# Altium schematic sheet [9]-STM32F407 Controller.SchDoc
size A3; Organization: Altium Limited; Address1: L3, 12a Rodborough Rd; Address2: Frenchs Forest; Address3: NSW; Address4: Australia 2086
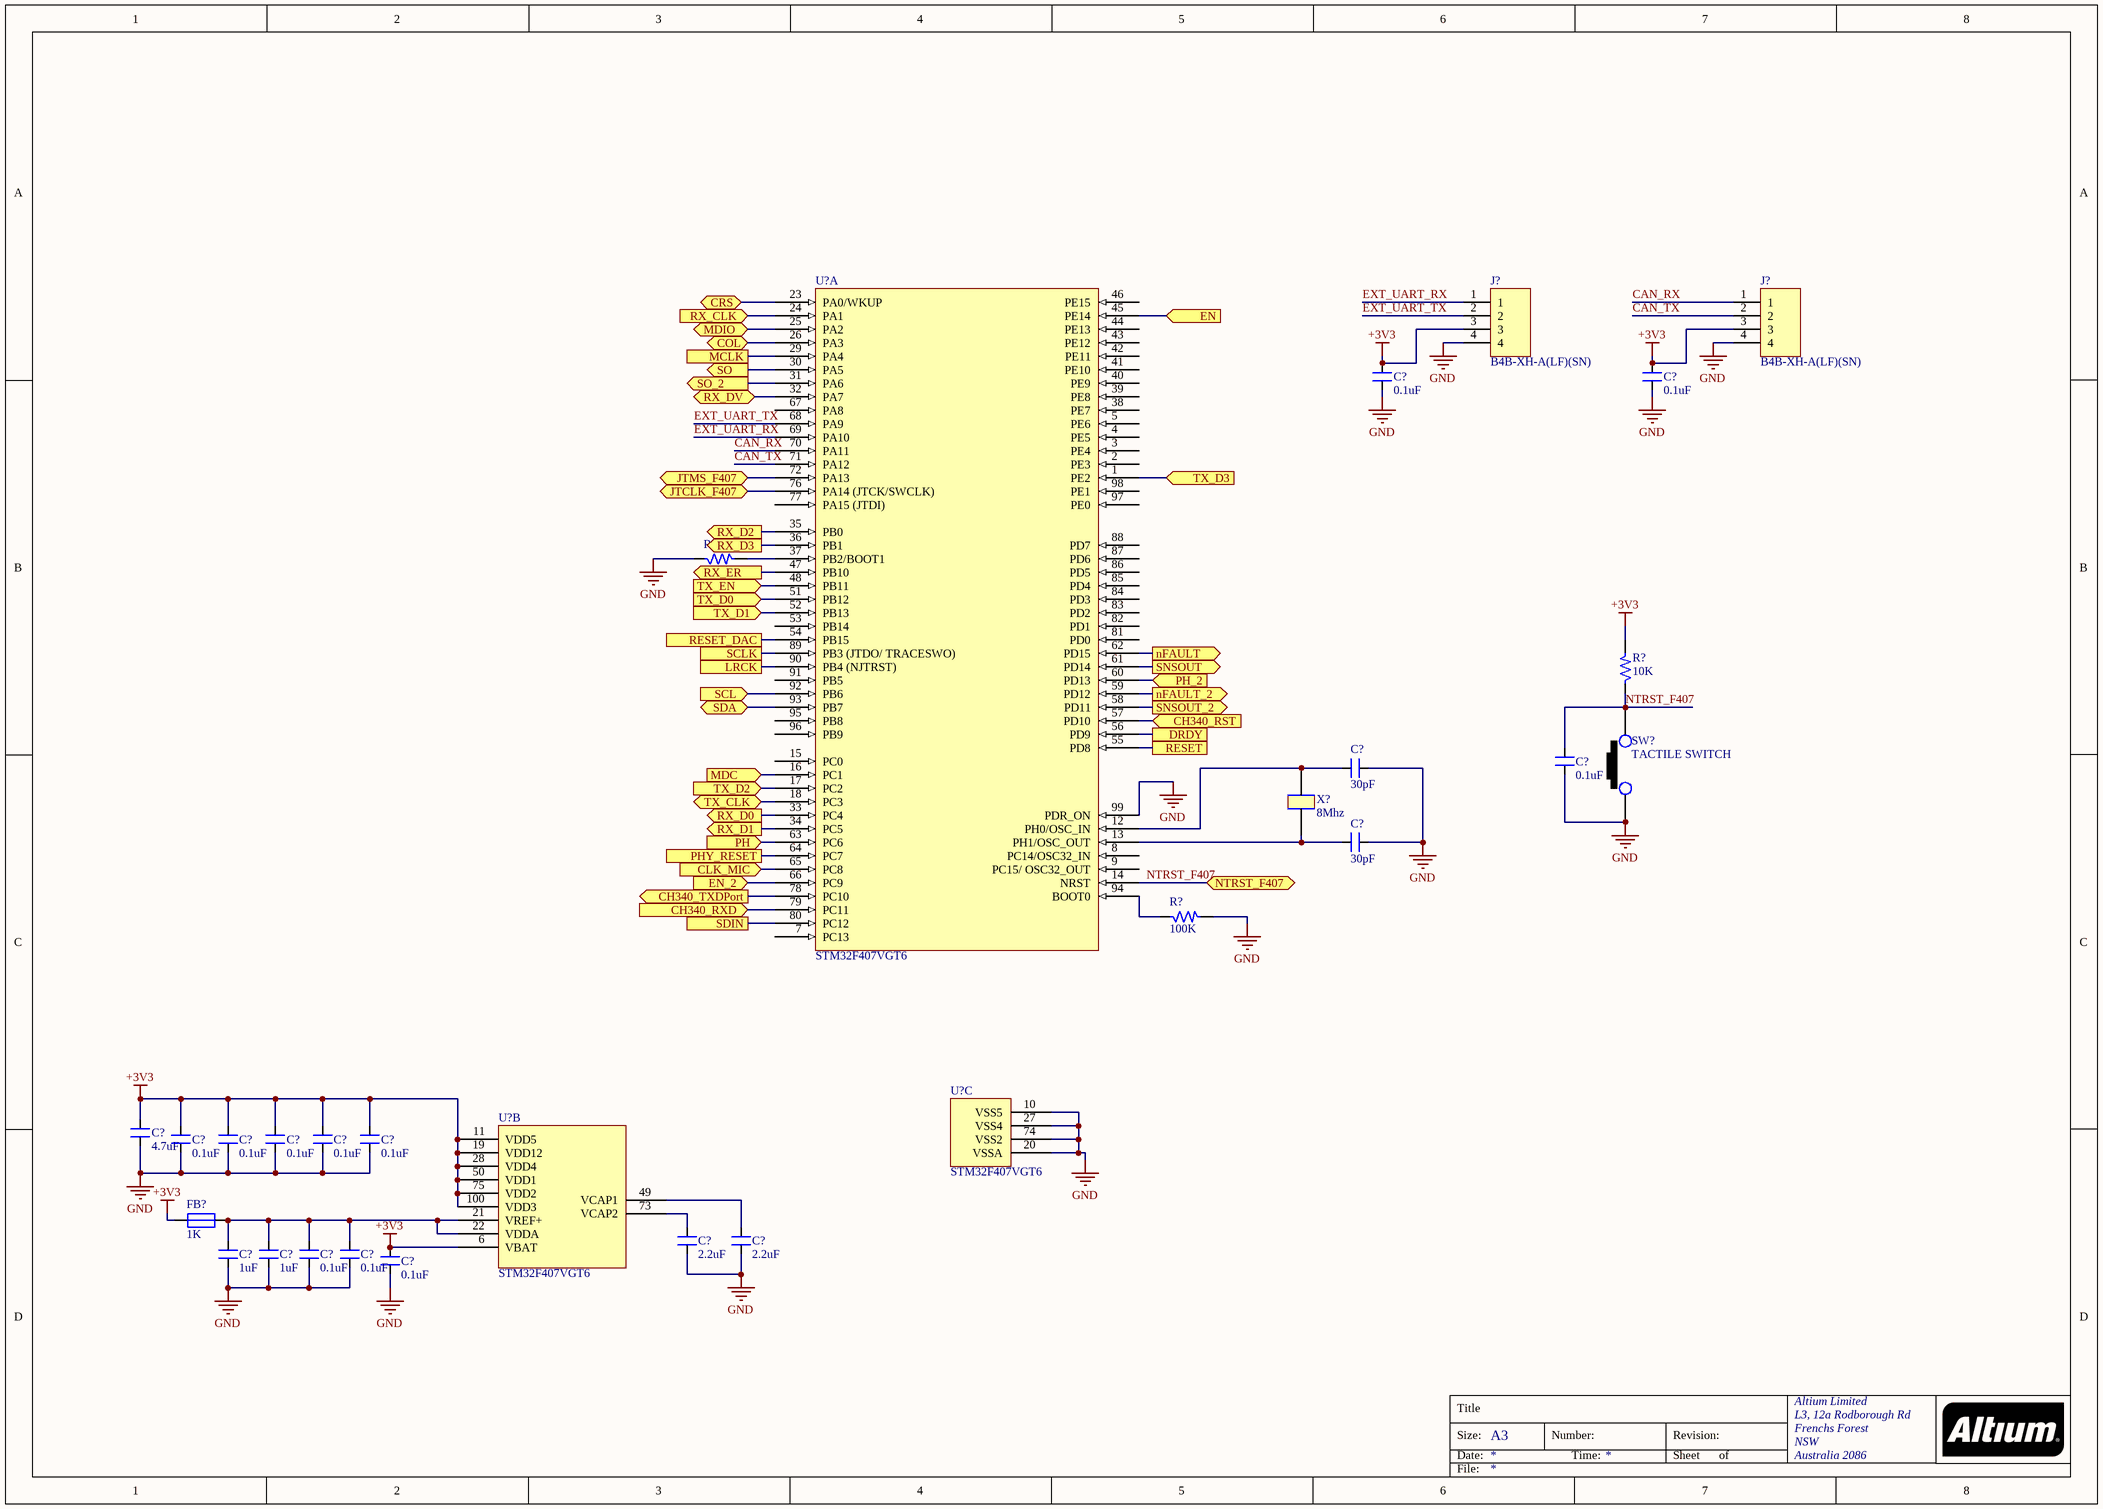
[diagram p0: [9]-STM32F407 Controller.SchDoc]

## Parts
(Parts that share a designator on the sheet are numbered #1, #2 ... from top to bottom, then left to right.)
C?#1  0.1uF  [CAP_0805]
C?#2  0.1uF  [CAP_0805]
C?#3  0.1uF  [CAP_0805]
C?#4  30pF  [CAP_0805]
C?#5  30pF  [CAP_0805]
C?#6  4.7uF  [CAP_0805]
C?#7  0.1uF  [CAP_0805]
C?#8  0.1uF  [CAP_0805]
C?#9  0.1uF  [CAP_0805]
C?#10  0.1uF  [CAP_0805]
C?#11  0.1uF  [CAP_0805]
C?#12  2.2uF  [CAP_0805]
C?#13  2.2uF  [CAP_0805]
C?#14  1uF  [CAP_0805]
C?#15  1uF  [CAP_0805]
C?#16  0.1uF  [CAP_0805]
C?#17  0.1uF  [CAP_0805]
C?#18  0.1uF  [CAP_0805]
FB?  1K  [IND_0805]
J?#1  B4B-XH-A(LF)(SN)  [CON4_100_B4B-XH-A_TH_ST]
J?#2  B4B-XH-A(LF)(SN)  [CON4_100_B4B-XH-A_TH_ST]
R?#1  100K  [RES_0603]
R?#2  10K  [RES_0603]
R?#3  100K  [RES_0603]
SW?  TACTILE SWITCH  [SW_342_SMD]
U?#1  STM32F407VGT6  [QFN100_19.6_669_58X10_SMD]  (part A of 3)
U?#2  STM32F407VGT6  [QFN100_19.6_669_58X10_SMD]  (part C of 3)
U?#3  STM32F407VGT6  [QFN100_19.6_669_58X10_SMD]  (part B of 3)
X?  8Mhz  [XTAL_314_240X47_SMD]

## Ports
CH340_RST (in), CH340_RXD (in), CH340_TXDPort (out), CLK_MIC (in), COL (bidir), CRS (bidir), DRDY, EN (in), EN_2 (in), JTCLK_F407 (bidir), JTMS_F407 (bidir), LRCK, MCLK, MDC (in), MDIO (bidir), nFAULT (out), nFAULT_2 (out), NTRST_F407 (bidir), PH (in), PH_2 (in), PHY_RESET, RESET, RESET_DAC, RX_CLK (in), RX_D0 (out), RX_D1 (out), RX_D2 (out), RX_D3 (out), RX_DV (bidir), RX_ER (out), SCL (in), SCLK, SDA (bidir), SDIN, SNSOUT (out), SNSOUT_2 (out), SO (out), SO_2 (out), TX_CLK (bidir), TX_D0 (in), TX_D1 (in), TX_D2 (in), TX_D3 (in), TX_EN (in)

## Nets
+3V3: C?#1.2 C?#2.2 C?#6.2 C?#7.2 C?#8.2 C?#9.2 C?#10.2 C?#11.2 C?#18.2 FB?.1 J?#1.3 J?#2.3 R?#2.2 U?#3.6(VBAT) U?#3.11(VDD5) U?#3.19(VDD12) U?#3.28(VDD4) U?#3.50(VDD1) U?#3.75(VDD2) U?#3.100(VDD3)
GND: C?#1.1 C?#2.1 C?#3.1 C?#4.2 C?#5.2 C?#6.1 C?#7.1 C?#8.1 C?#9.1 C?#10.1 C?#11.1 C?#12.1 C?#13.1 C?#14.1 C?#15.1 C?#16.1 C?#17.1 C?#18.1 J?#1.4 J?#2.4 R?#1.1 R?#3.2 SW?.1 U?#1.99(PDR_ON) U?#2.10(VSS5) U?#2.20(VSSA) U?#2.27(VSS4) U?#2.74(VSS2)
CAN_RX: J?#2.1 U?#1.70(PA11)
CAN_TX: J?#2.2 U?#1.71(PA12)
CH340_RST: U?#1.57(PD10) ; port CH340_RST
CH340_RXD: U?#1.79(PC11) ; port CH340_RXD
CH340_TXDPort: U?#1.78(PC10) ; port CH340_TXDPort
CLK_MIC: U?#1.65(PC8) ; port CLK_MIC
COL: U?#1.26(PA3) ; port COL
CRS: U?#1.23(PA0/WKUP) ; port CRS
DRDY: U?#1.56(PD9) ; port DRDY
EN: U?#1.45(PE14) ; port EN
EN_2: U?#1.66(PC9) ; port EN_2
EXT_UART_RX: J?#1.1 U?#1.69(PA10)
EXT_UART_TX: J?#1.2 U?#1.68(PA9)
JTCLK_F407: U?#1.76(PA14_(JTCK/SWCLK)) ; port JTCLK_F407
JTMS_F407: U?#1.72(PA13) ; port JTMS_F407
LRCK: U?#1.90(PB4_(NJTRST)) ; port LRCK
MCLK: U?#1.29(PA4) ; port MCLK
MDC: U?#1.16(PC1) ; port MDC
MDIO: U?#1.25(PA2) ; port MDIO
nFAULT: U?#1.62(PD15) ; port nFAULT
nFAULT_2: U?#1.59(PD12) ; port nFAULT_2
NTRST_F407: C?#3.2 R?#2.1 SW?.2 U?#1.14(NRST) ; port NTRST_F407
PH: U?#1.63(PC6) ; port PH
PH_2: U?#1.60(PD13) ; port PH_2
PHY_RESET: U?#1.64(PC7) ; port PHY_RESET
RESET: U?#1.55(PD8) ; port RESET
RESET_DAC: U?#1.54(PB15) ; port RESET_DAC
RX_CLK: U?#1.24(PA1) ; port RX_CLK
RX_D0: U?#1.33(PC4) ; port RX_D0
RX_D1: U?#1.34(PC5) ; port RX_D1
RX_D2: U?#1.35(PB0) ; port RX_D2
RX_D3: U?#1.36(PB1) ; port RX_D3
RX_DV: U?#1.32(PA7) ; port RX_DV
RX_ER: U?#1.47(PB10) ; port RX_ER
SCL: U?#1.92(PB6) ; port SCL
SCLK: U?#1.89(PB3_(JTDO/_TRACESWO)) ; port SCLK
SDA: U?#1.93(PB7) ; port SDA
SDIN: U?#1.80(PC12) ; port SDIN
SNSOUT: U?#1.61(PD14) ; port SNSOUT
SNSOUT_2: U?#1.58(PD11) ; port SNSOUT_2
SO: U?#1.30(PA5) ; port SO
SO_2: U?#1.31(PA6) ; port SO_2
TX_CLK: U?#1.18(PC3) ; port TX_CLK
TX_D0: U?#1.51(PB12) ; port TX_D0
TX_D1: U?#1.52(PB13) ; port TX_D1
TX_D2: U?#1.17(PC2) ; port TX_D2
TX_D3: U?#1.1(PE2) ; port TX_D3
TX_EN: U?#1.48(PB11) ; port TX_EN
NetC?#4_1: C?#4.1 U?#1.12(PH0/OSC_IN) X?.2
NetC?#5_1: C?#5.1 U?#1.13(PH1/OSC_OUT) X?.1
NetC?#12_2: C?#12.2 U?#3.73(VCAP2)
NetC?#13_2: C?#13.2 U?#3.49(VCAP1)
NetC?#14_2: C?#14.2 C?#15.2 C?#16.2 C?#17.2 FB?.2 U?#3.21(VREF+) U?#3.22(VDDA)
NetR?#1_2: R?#1.2 U?#1.37(PB2/BOOT1)
NetR?#3_1: R?#3.1 U?#1.94(BOOT0)

Not connected (* = marked no-connect by the designer): U?#1 2(PE3) 3(PE4) 4(PE5) 5(PE6) 7(PC13) 8(PC14/OSC32_IN) 9(PC15/_OSC32_OUT) 15(PC0) 38(PE7) 39(PE8) 40(PE9) 41(PE10) 42(PE11) 43(PE12) 44(PE13) 46(PE15) 53(PB14) 67(PA8) 77(PA15_(JTDI)) 81(PD0) 82(PD1) 83(PD2) 84(PD3) 85(PD4) 86(PD5) 87(PD6) 88(PD7) 91(PB5) 95(PB8) 96(PB9) 97(PE0) 98(PE1)

## Notes on the sheet
- Title
- Size:
- Date:
- A3
- Number:
- Time:
- Revision:
- Sheet
- of
- File:

## Library data of the parts
C?#1-C?#3 C?#7-C?#11 C?#16-C?#18 = CAP_0.1uF-50V-10%-0805: 0.1µF ±10% 50V Ceramic Capacitor X7R 0805 (2012 Metric) /; Manufacturer: Samsung; Manufacturer Part Number: CL21B104KBCNNNC; Alternate Part Number-1: NA; Case/Package: 0805; Supplier-1: SIRICOM; Supplier Part Number-1: 0805B104K500CT
C?#4 C?#5 = CAP_30pF-50V-10%-0805: ±10% 50V Ceramic Capacitor C0G, NP0 0805 (2012 Metric) /; Manufacturer Part Number: C0805C300K5GAC7800; Manufacturer: KEMET; Alternate Part Number: NA; Case/Package: 0805; Supplier-1: Digikey; Supplier Part Number-1: 399-17443-1-ND - Cut Tape (CT)
C?#6 = CAP_4.7uF-50V-10%-0805: 4.7µF ±10% 50V Ceramic Capacitor X5R 0805 (2012 Metric) /; Manufacturer: Yageo; Manufacturer Part Number: GRM21BR61H475KE51L; Alternate Part Number-1: NA; Case/Package: 0805; Supplier-1: SIRICOM; Supplier Part Number-1: CL21A475KBQNNNE
C?#12 C?#13 = CAP_2.2uF-25V-10%-0805: 2.2µF ±10% 25V Ceramic Capacitor X7R 0805 (2012 Metric) /; Manufacturer: KEMET; Manufacturer Part Number: CL21B225KAFNFNE; Alternate Part Number-1: NA; Case/Package: 0805; Supplier-1: SIRICOM; Supplier Part Number-1: CL21A225KAFNNNE
C?#14 C?#15 = CAP_1uF-50V-5%-0805: 1µF ±5% 50V Ceramic Capacitor X7R 0805 (2012 Metric) /; Manufacturer: Samsung; Manufacturer Part Number: CC0805JKX7R9BB105; Alternate Part Number-1: 0805F105M500NT; Case/Package: 0805; Supplier-1: SIRICOM; Supplier Part Number-1: CL21B105KBFNNNE
FB? = FB_1K-100MHZ-1.6A-0805: 1 kOhms @ 100MHz 1 Power Line Ferrite Bead 0805 (2012 Metric) 1.6A; Manufacturer: Laird; Manufacturer Part Number: BLM21SP102SH1D; Alternate Part Number-1: NA; Case/Package: 0805; Supplier-1: SIRICOM; Supplier Part Number-1: ACMS201209A102
J?#1 J?#2 = CON-PLG_4X1-100-ST-TH: 4 Pins, 1 Row 2.54mm Pitch, straight Connector, male; Manufacturer: Wurth Electronics; Mating Part Number: XHP-4; Crimp Part Number: ASXHSXH22K51; Alternate Part Number-1: NA; Manufacturer Part Number: B4B-XH-A(LF)(SN); Case/Package: TH-CON; Supplier-1: LCSC; Supplier Part Number-1: B4B-XH-A(LF)(SN)
R?#1 R?#3 = RES_100K-0.1W-1%-0603: 100 kOhms ±1% 0.1W, 1/10W Chip Resistor 0603 (1608 Metric) Automotive AEC-Q200 Thick Film /; Manufacturer: Stackpole Electronics; Manufacturer Part Number: RMCF0603FT100K; Alternate Part Number-1: NA; Case/Package: 0603; Supplier-1: Arrow; Supplier Part Number-1: RMCF0603FT100K
R?#2 = RES_10K-0.1W-1%-0603: 10 kOhms ±1% 0.1W, 1/10W Chip Resistor 0603 (1608 Metric) Automotive AEC-Q200 Thick Film /; Manufacturer: Walsin; Manufacturer Part Number: WR06X1002FTL; Alternate Part Number-1: 0603WAJ0103T5E; Case/Package: 0603; Supplier-1: SIRICOM; Supplier Part Number-1: WR06X1002FTL
SW? = SW1_RS-282G05A3-SMRT-SMD: Tactile Switch SPST-NO Top Actuated Surface Mount; Manufacturer: ITT C&K; Alternate Part Number-1: NA; Manufacturer Part Number: RS-282G05A3-SMRT; Case/Package: SMD; Supplier-1: SP ROAD; Supplier Part Number-1: RS-282G05A3-SMRT
U?#1-U?#3 = IC_STM32F407VGT6: ARM® Cortex®-M4 STM32F4 Microcontroller IC 32-Bit 168MHz 1MB (1M x 8) FLASH 100-LQFP (14x14) /; Manufacturer: STMicroelectronics; Alternate Part Number-1: STM32F407VET6; Manufacturer Part Number: STM32F407VGT6; Case/Package: LQFP100; Supplier-1: ARROW; Supplier Part Number-1: STM32F407VGT6
X? = XTAL_8MHZ-ECS-80-32-5PX-SMD: 8MHz ±30ppm Crystal 32pF 60 Ohms HC-49/US /; Manufacturer: Fox Electronics; Manufacturer Part Number: ECS-80-32-5PX-TR; Alternate Part Number-1: NA; Case/Package: SMD/SMT; Supplier-1: SP ROAD; Supplier Part Number-1: ECS-80-32-5PX-TR